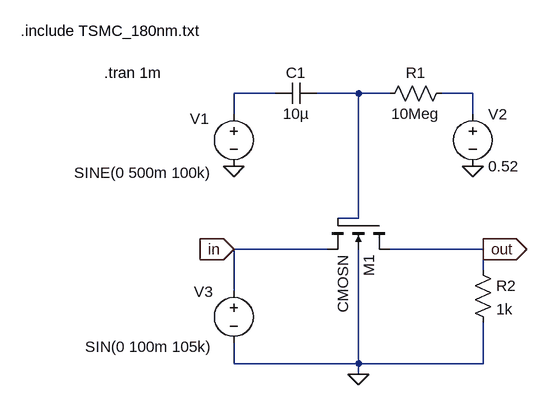
[diagram p0: schematic mixer_test.asc]
mixer_test.asc, the LTspice schematic file:
Version 4.1
SHEET 1 916 680
WIRE 80 32 16 32
WIRE 208 32 144 32
WIRE 256 32 208 32
WIRE 384 32 336 32
WIRE 16 64 16 32
WIRE 384 64 384 32
WIRE 208 224 208 32
WIRE 208 224 176 224
WIRE 160 272 16 272
WIRE 400 272 256 272
WIRE 400 304 400 272
WIRE 16 336 16 272
WIRE 16 448 16 416
WIRE 208 448 208 272
WIRE 208 448 16 448
WIRE 400 448 400 384
WIRE 400 448 208 448
WIRE 208 464 208 448
FLAG 16 144 0
FLAG 384 144 0
FLAG 208 464 0
FLAG 400 272 out
IOPIN 400 272 Out
FLAG 16 272 in
IOPIN 16 272 In
SYMBOL voltage 16 48 R0
WINDOW 0 -67 23 Left 2
WINDOW 3 -246 106 Left 2
SYMATTR InstName V1
SYMATTR Value SINE(0 500m 100k)
SYMBOL voltage 384 48 R0
SYMATTR InstName V2
SYMATTR Value 0.52
SYMBOL voltage 16 320 R0
WINDOW 0 -61 17 Left 2
WINDOW 3 -229 102 Left 2
SYMATTR InstName V3
SYMATTR Value SIN(0 100m 105k)
SYMBOL cap 144 16 R90
WINDOW 0 0 32 VBottom 2
WINDOW 3 32 32 VTop 2
SYMATTR InstName C1
SYMATTR Value 10µ
SYMBOL res 352 16 R90
WINDOW 0 0 56 VBottom 2
WINDOW 3 32 56 VTop 2
SYMATTR InstName R1
SYMATTR Value 10Meg
SYMBOL res 384 288 R0
SYMATTR InstName R2
SYMATTR Value 1k
SYMBOL nmos4 256 224 R90
SYMATTR InstName M1
SYMATTR Value CMOSN
SYMATTR Value2 l = 0.18u w = 1
TEXT -312 -64 Left 2 !.include TSMC_180nm.txt
TEXT -184 0 Left 2 !.tran 1m

The netlist it stands for:
* mixer_test.asc
V1 N001 0 SINE(0 500m 100k)
V2 N003 0 0.52
V3 in 0 SIN(0 100m 105k)
C1 N002 N001 10µ
R1 N003 N002 10Meg
R2 out 0 1k
M1 out N002 in 0 CMOSN l = 0.18u w = 1
.model NMOS NMOS
.model PMOS PMOS
.lib standard.mos
.include TSMC_180nm.txt
.tran 1m
.backanno
.end